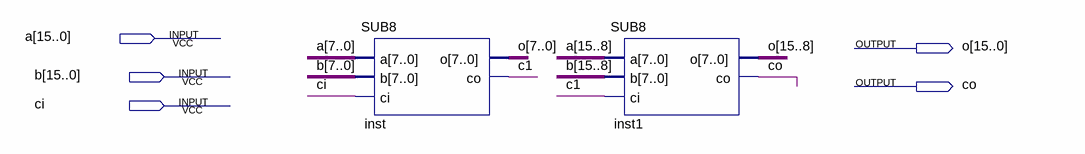
[diagram p0: schematic sheet]
// Quartus schematic SUB16.bdf as structural Verilog: 2 symbols, 5 pins
module SUB16 (
  input  [15:0] a,
  input  [15:0] b,
  input  ci,
  output [15:0] o,
  output co
);

  wire c1;

  SUB8 inst (.a(a[7:0]), .b(b[7:0]), .ci(ci), .o(o[7:0]), .co(c1));
  SUB8 inst1 (.a(a[15:8]), .b(b[15:8]), .ci(c1), .o(o[15:8]), .co(co));
endmodule
